# Altium schematic sheet УШЯИ.687253.019Э3_1.SchDoc
size 209 x 297 mm; SheetTotal: 1
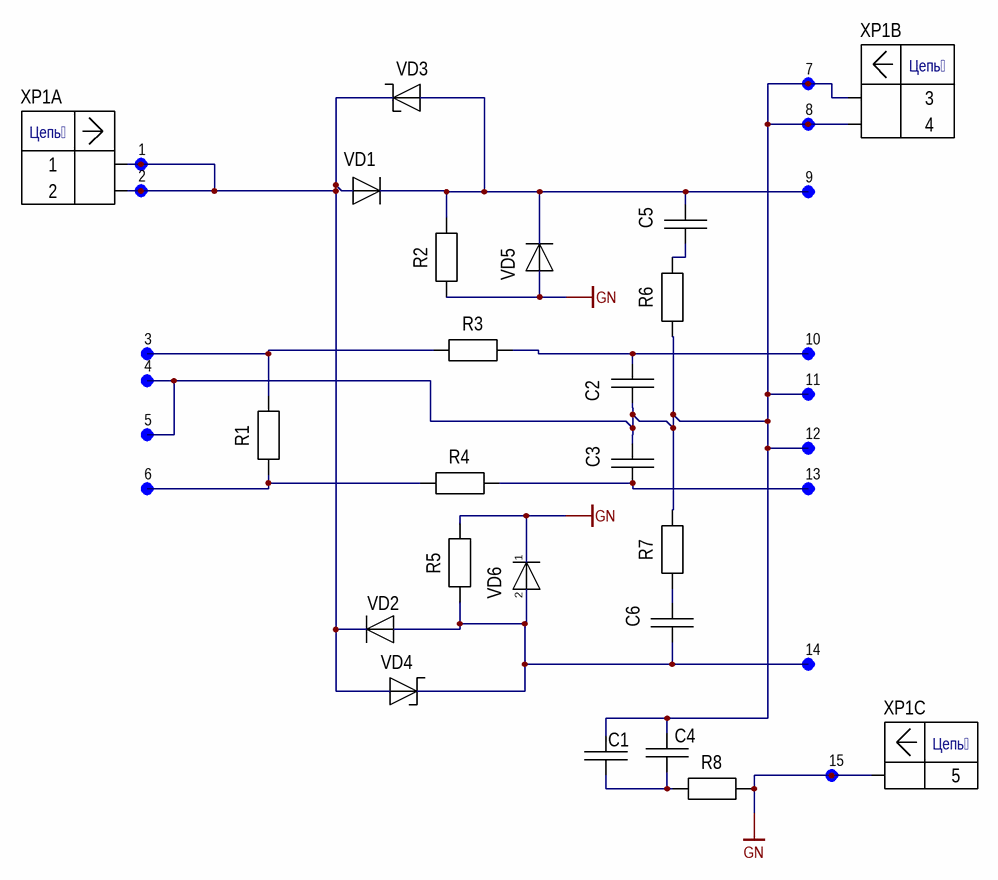
[diagram p0: УШЯИ.687253.019Э3_1.SchDoc]

## Parts
1  OTV18  [OTV18]  (value not drawn)  (mechanical)
2  OTV18  [OTV18]  (value not drawn)  (mechanical)
3  OTV18  [OTV18]  (value not drawn)  (mechanical)
4  OTV18  [OTV18]  (value not drawn)  (mechanical)
5  OTV18  [OTV18]  (value not drawn)  (mechanical)
6  OTV18  [OTV18]  (value not drawn)  (mechanical)
7  OTV18  [OTV18]  (value not drawn)  (mechanical)
8  OTV18  [OTV18]  (value not drawn)  (mechanical)
9  OTV18  [OTV18]  (value not drawn)  (mechanical)
10  OTV18  [OTV18]  (value not drawn)  (mechanical)
11  OTV18  [OTV18]  (value not drawn)  (mechanical)
12  OTV18  [OTV18]  (value not drawn)  (mechanical)
13  OTV18  [OTV18]  (value not drawn)  (mechanical)
14  OTV18  [OTV18]  (value not drawn)  (mechanical)
15  OTV18  [OTV18]  (value not drawn)  (mechanical)
C1  К73-17-250 В-1 мкФ +-20%  [К73-17-А20]  (value not drawn)
C2  GRM2165C2A102JA01D  [GRM216 IPC_B]  (value not drawn)
C3  GRM2165C2A102JA01D  [GRM216 IPC_B]  (value not drawn)
C4  К73-17-250 В-1 мкФ +-20%  [К73-17-А20]  (value not drawn)
C5  К73-17-250 В-0,47 мкФ +-20%  [К73-17-А20]  (value not drawn)
C6  К73-17-250 В-0,47 мкФ +-20%  [К73-17-А20]  (value not drawn)
R1  1206-9,1 кОм+-5%  [1206]  (value not drawn)
R2  1206-9,1 кОм+-5%  [1206]  (value not drawn)
R3  1206-240 Ом+-5%  [1206]  (value not drawn)
R4  1206-240 Ом+-5%  [1206]  (value not drawn)
R5  1206-9,1 кОм+-5%  [1206]  (value not drawn)
R6  1206-150 Ом+-5%  [1206]  (value not drawn)
R7  1206-150 Ом+-5%  [1206]  (value not drawn)
R8  1206-100 Ом+-5%  [1206]  (value not drawn)
VD1  43CTQ100  [TO-220(F)]  (value not drawn)
VD2  43CTQ100  [TO-220(F)]  (value not drawn)
VD3  1,5KE68CA  [DO-201]  (value not drawn)
VD4  1,5KE68CA  [DO-201]  (value not drawn)
VD5  1N4007  [DO-35]  (value not drawn)
VD6  1N4007  [DO-35]  (value not drawn)
XP1  MNL-350810-1  [350810-1]  (value not drawn)  (parts A,B,C of 3)

## Nets
GN: 15.1 R2.1 R5.2 R8.2 VD5.2 VD6.1 XP1.5
Net1_1: 1.1 2.1 VD1.1 VD2.2 VD3.1 VD4.2 XP1.1 XP1.2
Net3_1: 3.1 R1.2 R3.1
Net4_1: 4.1 5.1 7.1 8.1 11.1 12.1 C1.2 C2.2 C3.2 C4.2 R6.1 R7.2 XP1.3 XP1.4
Net6_1: 6.1 R1.1 R4.1
Net9_1: 9.1 C5.2 R2.2 VD1.2 VD3.2 VD5.1
Net10_1: 10.1 C2.1 R3.2
Net13_1: 13.1 C3.1 R4.2
Net14_1: 14.1 C6.1 R5.1 VD2.1 VD4.1 VD6.2
NetC1_1: C1.1 C4.1 R8.1
NetC5_1: C5.1 R6.2
NetC6_2: C6.2 R7.1

## Notes on the sheet
- 3
- 1
- 4
- 2
- 5
- Перв. примен.
- Справ. №
- Подп. дата
- Инв. № дубл.
- Взам. инв. №
- Подп. и дата
- Изм.
- Разраб.
- Лист
- № докум.
- Подп.
- Дата
- Лит.
- Масса
- Масштаб
- Пров.
- Т.контр.
- Листов
- Инв. № подл.
- Н.контр.
- Утв.
- Файл:
- ALTIUM GOSTBOM2.0 KEV
- Копировал
- Формат А4
- (in symbol MNL-350810-1, part A) Цепь
- (in symbol MNL-350810-1, part B) Цепь
- (in symbol MNL-350810-1, part C) Цепь

## Library data of the parts
C2 C3 = GRM2165C2A102JA01D: 0805 1000 pF 100 V ±5% Tolerance X7R Multilayer Ceramic Chip Capacitor; Value: 1000 пФ; Tolerance: 5%
R1 R2 R5 = 1206-9,1 кОм+-5%: Value: 9,1 кОм; ModelPrint: 1206
R3 R4 = 1206-240 Ом+-5%: Value: 240 Ом; ModelPrint: 1206
R6 R7 = 1206-150 Ом+-5%: Value: 150 Ом; ModelPrint: 1206
R8 = 1206-100 Ом+-5%: Value: 100 Ом; ModelPrint: 1206
VD1 VD2 = 43CTQ100: High Performance Schottky Rectifier, 2 x 20 A; pin to pad: 1>1+3; Value: *
VD3 VD4 = 1,5KE56CA: Супрессор 1,5KE68CA; Value: *
VD5 VD6 = 1N4007: General Purpose Plastic Rectifier; Value: *
C1 C4 = К73-17-250 В-1 мкФ +-20%: Value: *
C5 C6 = К73-17-250 В-0,47 мкФ +-20%: Value: *